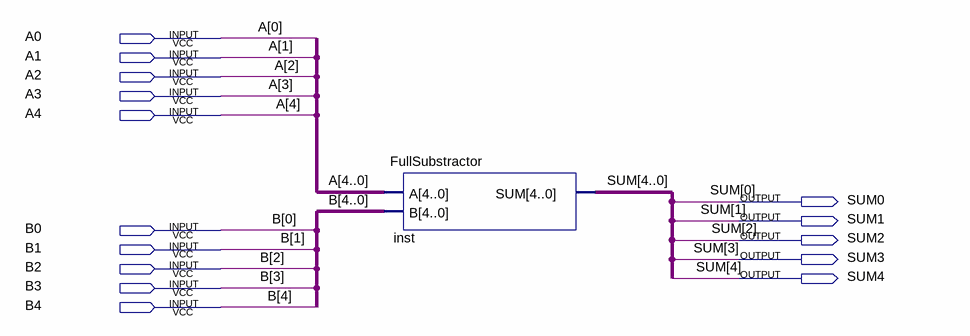
[diagram p0: schematic sheet]
// Quartus schematic FullSubstractorAdapter.bdf as structural Verilog: 1 symbols, 15 pins
module FullSubstractorAdapter (
  input  A0,
  input  A1,
  input  A2,
  input  A3,
  input  A4,
  input  B0,
  input  B1,
  input  B2,
  input  B3,
  input  B4,
  output SUM0,
  output SUM1,
  output SUM2,
  output SUM3,
  output SUM4
);

  FullSubstractor inst (.A({A4, A3, A2, A1, A0}), .B({B4, B3, B2, B1, B0}), .SUM({SUM4, SUM3, SUM2, SUM1, SUM0}));
endmodule
